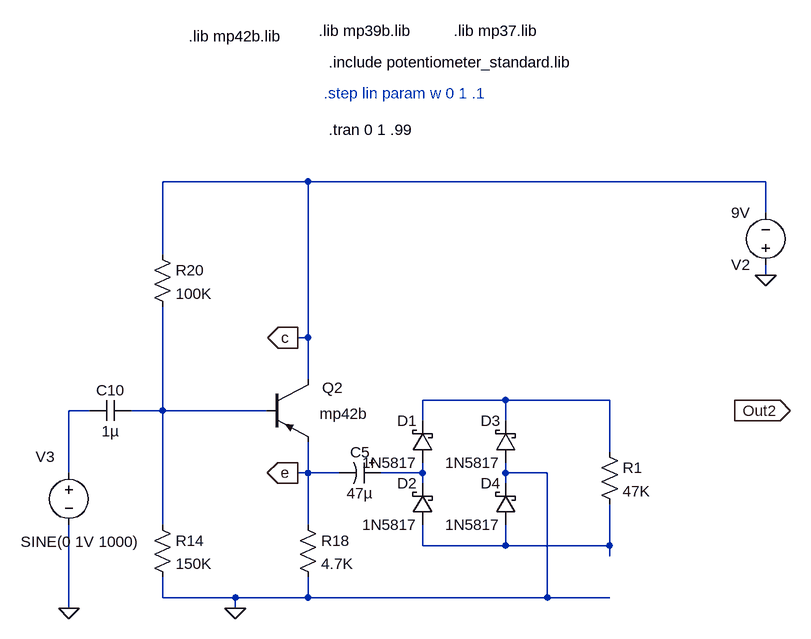
[diagram p0: schematic octaver2.asc]
octaver2.asc, the LTspice schematic file:
Version 4
SHEET 1 984 1092
WIRE -896 0 -1120 0
WIRE -192 0 -896 0
WIRE -192 48 -192 0
WIRE -1120 112 -1120 0
WIRE -192 144 -192 128
WIRE -896 240 -896 0
WIRE -896 240 -912 240
WIRE -896 304 -896 240
WIRE -592 336 -720 336
WIRE -432 336 -592 336
WIRE -1232 352 -1264 352
WIRE -1120 352 -1120 192
WIRE -1120 352 -1168 352
WIRE -960 352 -1120 352
WIRE -720 368 -720 336
WIRE -592 368 -592 336
WIRE -432 416 -432 336
WIRE -1264 448 -1264 352
WIRE -896 448 -896 400
WIRE -896 448 -912 448
WIRE -848 448 -896 448
WIRE -720 448 -720 432
WIRE -720 448 -784 448
WIRE -592 448 -592 432
WIRE -528 448 -592 448
WIRE -720 464 -720 448
WIRE -592 464 -592 448
WIRE -1120 528 -1120 352
WIRE -896 528 -896 448
WIRE -720 560 -720 528
WIRE -592 560 -592 528
WIRE -592 560 -720 560
WIRE -432 560 -432 496
WIRE -432 560 -592 560
WIRE -432 576 -432 560
WIRE -1120 640 -1120 608
WIRE -1008 640 -1120 640
WIRE -896 640 -896 608
WIRE -896 640 -1008 640
WIRE -528 640 -528 448
WIRE -528 640 -896 640
WIRE -432 640 -528 640
WIRE -1264 656 -1264 528
WIRE -1008 656 -1008 640
FLAG -192 144 0
FLAG -240 352 Out2
IOPIN -240 352 Out
FLAG -1264 656 0
FLAG -1008 656 0
FLAG -912 240 c
IOPIN -912 240 Out
FLAG -912 448 e
IOPIN -912 448 Out
SYMBOL voltage -192 144 R180
WINDOW 123 0 0 Left 2
WINDOW 39 24 -12 Left 2
SYMATTR InstName V2
SYMATTR Value 9V
SYMBOL voltage -1264 432 R0
WINDOW 39 -112 95 Left 2
WINDOW 3 -74 122 Left 2
WINDOW 0 -51 -9 Left 2
SYMATTR Value SINE(0 1V 1000)
SYMATTR InstName V3
SYMATTR Value2 AC 1
SYMBOL pnp -960 304 R0
WINDOW 0 86 13 Left 2
WINDOW 3 82 53 Left 2
SYMATTR InstName Q2
SYMATTR Value mp42b
SYMBOL res -1136 512 R0
SYMATTR InstName R14
SYMATTR Value 150K
SYMBOL res -912 512 R0
SYMATTR InstName R18
SYMATTR Value 4.7K
SYMBOL res -1136 96 R0
SYMATTR InstName R20
SYMATTR Value 100K
SYMBOL cap -1168 336 R90
WINDOW 0 0 32 VBottom 2
WINDOW 3 32 32 VTop 2
SYMATTR InstName C10
SYMATTR Value 1µ
SYMBOL polcap -784 432 R90
WINDOW 0 0 32 VBottom 2
WINDOW 3 32 32 VTop 2
SYMATTR InstName C5
SYMATTR Value 47µ
SYMBOL res -448 400 R0
SYMATTR InstName R1
SYMATTR Value 47K
SYMBOL schottky -704 432 R180
WINDOW 0 24 64 Left 2
WINDOW 3 24 0 Left 2
SYMATTR InstName D1
SYMATTR Value 1N5817
SYMATTR Description Diode
SYMATTR Type diode
SYMBOL schottky -704 528 R180
WINDOW 0 24 64 Left 2
WINDOW 3 24 0 Left 2
SYMATTR InstName D2
SYMATTR Value 1N5817
SYMATTR Description Diode
SYMATTR Type diode
SYMBOL schottky -576 432 R180
WINDOW 0 24 64 Left 2
WINDOW 3 24 0 Left 2
SYMATTR InstName D3
SYMATTR Value 1N5817
SYMATTR Description Diode
SYMATTR Type diode
SYMBOL schottky -576 528 R180
WINDOW 0 24 64 Left 2
WINDOW 3 24 0 Left 2
SYMATTR InstName D4
SYMATTR Value 1N5817
SYMATTR Description Diode
SYMATTR Type diode
TEXT -880 -232 Left 2 !.lib mp39b.lib
TEXT -672 -232 Left 2 !.lib mp37.lib
TEXT -864 -184 Left 2 !.include potentiometer_standard.lib
TEXT -872 -136 Left 2 ;.step lin param w 0 1 .1
TEXT -864 -80 Left 2 !.tran 0 1 .99
TEXT -1080 -224 Left 2 !.lib mp42b.lib

The netlist it stands for:
* octaver2.asc
V2 0 c 9V
V3 N002 0 SINE(0 1V 1000) AC 1
Q2 c N003 e 0 mp42b
R14 N003 0 150K
R18 e 0 4.7K
R20 c N003 100K
C10 N003 N002 1µ
C5 N004 e 47µ
R1 N001 N005 47K
D1 N004 N001 1N5817
D2 N005 N004 1N5817
D3 0 N001 1N5817
D4 N005 0 1N5817
.model D D
.lib standard.dio
.model NPN NPN
.model PNP PNP
.lib standard.bjt
.lib mp39b.lib
.lib mp37.lib
.include potentiometer_standard.lib
* .step lin param w 0 1 .1
.tran 0 1 .99
.lib mp42b.lib
.backanno
.end